# Altium schematic sheet SamtechConnector.SchDoc
size A4; SheetNumber: 3; SheetTotal: 7
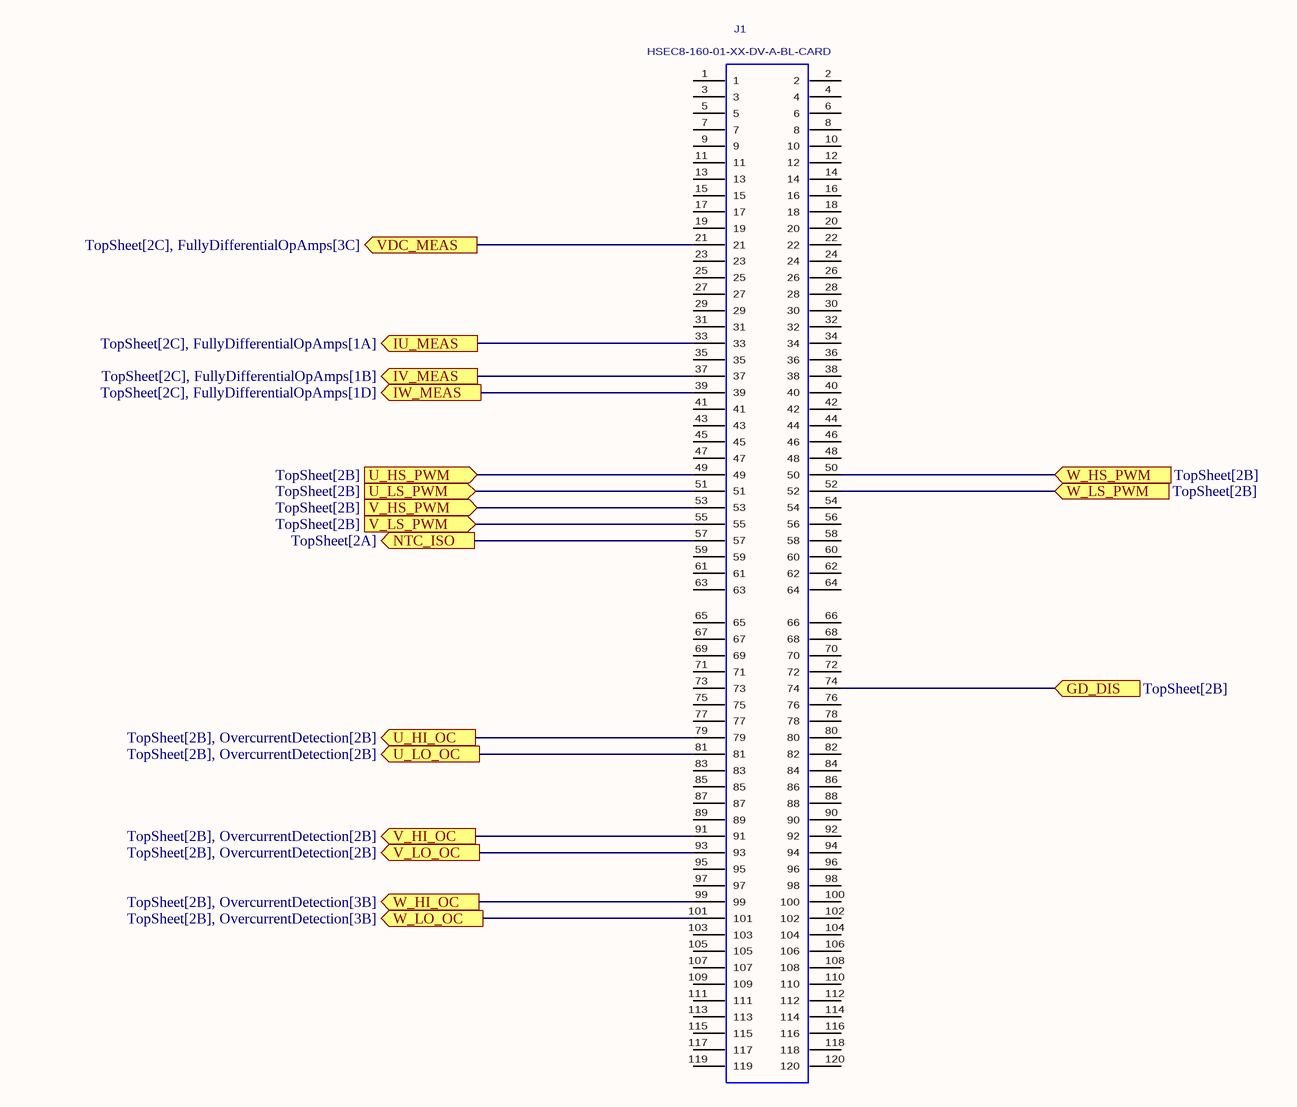
[diagram p0: SamtechConnector.SchDoc]

## Parts
J1  HSEC8-160-01-XX-DV-A-BL-CARD  [HSEC8-160-01-XX-DV-A-BL-CARD]

## Ports
GD_DIS (in, see TopSheet[2B]), IU_MEAS (out, see TopSheet[2C], FullyDifferentialOpAmps[1A]), IV_MEAS (out, see TopSheet[2C], FullyDifferentialOpAmps[1B]), IW_MEAS (out, see TopSheet[2C], FullyDifferentialOpAmps[1D]), NTC_ISO (out, see TopSheet[2A]), U_HI_OC (out, see TopSheet[2B], OvercurrentDetection[2B]), U_HS_PWM (in, see TopSheet[2B]), U_LO_OC (out, see TopSheet[2B], OvercurrentDetection[2B]), U_LS_PWM (in, see TopSheet[2B]), V_HI_OC (out, see TopSheet[2B], OvercurrentDetection[2B]), V_HS_PWM (in, see TopSheet[2B]), V_LO_OC (out, see TopSheet[2B], OvercurrentDetection[2B]), V_LS_PWM (in, see TopSheet[2B]), VDC_MEAS (out, see TopSheet[2C], FullyDifferentialOpAmps[3C]), W_HI_OC (out, see TopSheet[2B], OvercurrentDetection[3B]), W_HS_PWM (in, see TopSheet[2B]), W_LO_OC (out, see TopSheet[2B], OvercurrentDetection[3B]), W_LS_PWM (in, see TopSheet[2B])

## Nets
GD_DIS: J1.74 ; port GD_DIS
IU_MEAS: J1.33 ; port IU_MEAS
IV_MEAS: J1.37 ; port IV_MEAS
IW_MEAS: J1.39 ; port IW_MEAS
NTC_ISO: J1.57 ; port NTC_ISO
U_HI_OC: J1.79 ; port U_HI_OC
U_HS_PWM: J1.49 ; port U_HS_PWM
U_LO_OC: J1.81 ; port U_LO_OC
U_LS_PWM: J1.51 ; port U_LS_PWM
V_HI_OC: J1.91 ; port V_HI_OC
V_HS_PWM: J1.53 ; port V_HS_PWM
V_LO_OC: J1.93 ; port V_LO_OC
V_LS_PWM: J1.55 ; port V_LS_PWM
VDC_MEAS: J1.21 ; port VDC_MEAS
W_HI_OC: J1.99 ; port W_HI_OC
W_HS_PWM: J1.50 ; port W_HS_PWM
W_LO_OC: J1.101 ; port W_LO_OC
W_LS_PWM: J1.52 ; port W_LS_PWM

Not connected (* = marked no-connect by the designer): J1 1 2 3 4 5 6 7 8 9 10 11 12 13 14 15 16 17 18 19 20 22 23 24 25 26 27 28 29 30 31 32 34 35 36 38 40 41 42 43 44 45 46 47 48 54 56 58 59 60 61 62 63 64 65 66 67 68 69 70 71 72 73 75 76 77 78 80 82 83 84 85 86 87 88 89 90 92 94 95 96 97 98 100 102 103 104 105 106 107 108 109 110 111 112 113 114 115 116 117 118 119 120

## Library data of the parts
J1 = HSEC8-160-01-XX-DV-A-BL-CARD: MATING CARD LAYOUT FOR HSEC8-160-01-XX-DV-A-BL.; MANUFACTURER: SAMTEC; CREATED: April 20, 2018 - Wendy Xin; PCB DECAL: HSEC8-160-01-XX-DV-A-BL-CARD; Design Item ID: HSEC8-160-01-XX-DV-A-BL-CARD; Source: HSEC8-160-01-XX-DV-A-BL-CARD.SCHLIB; Component Type: Standard; Pin Count: 120